# Altium schematic sheet GMSL_DESERIALIZER.SchDoc
size C; SheetNumber: 3; SheetTotal: 7
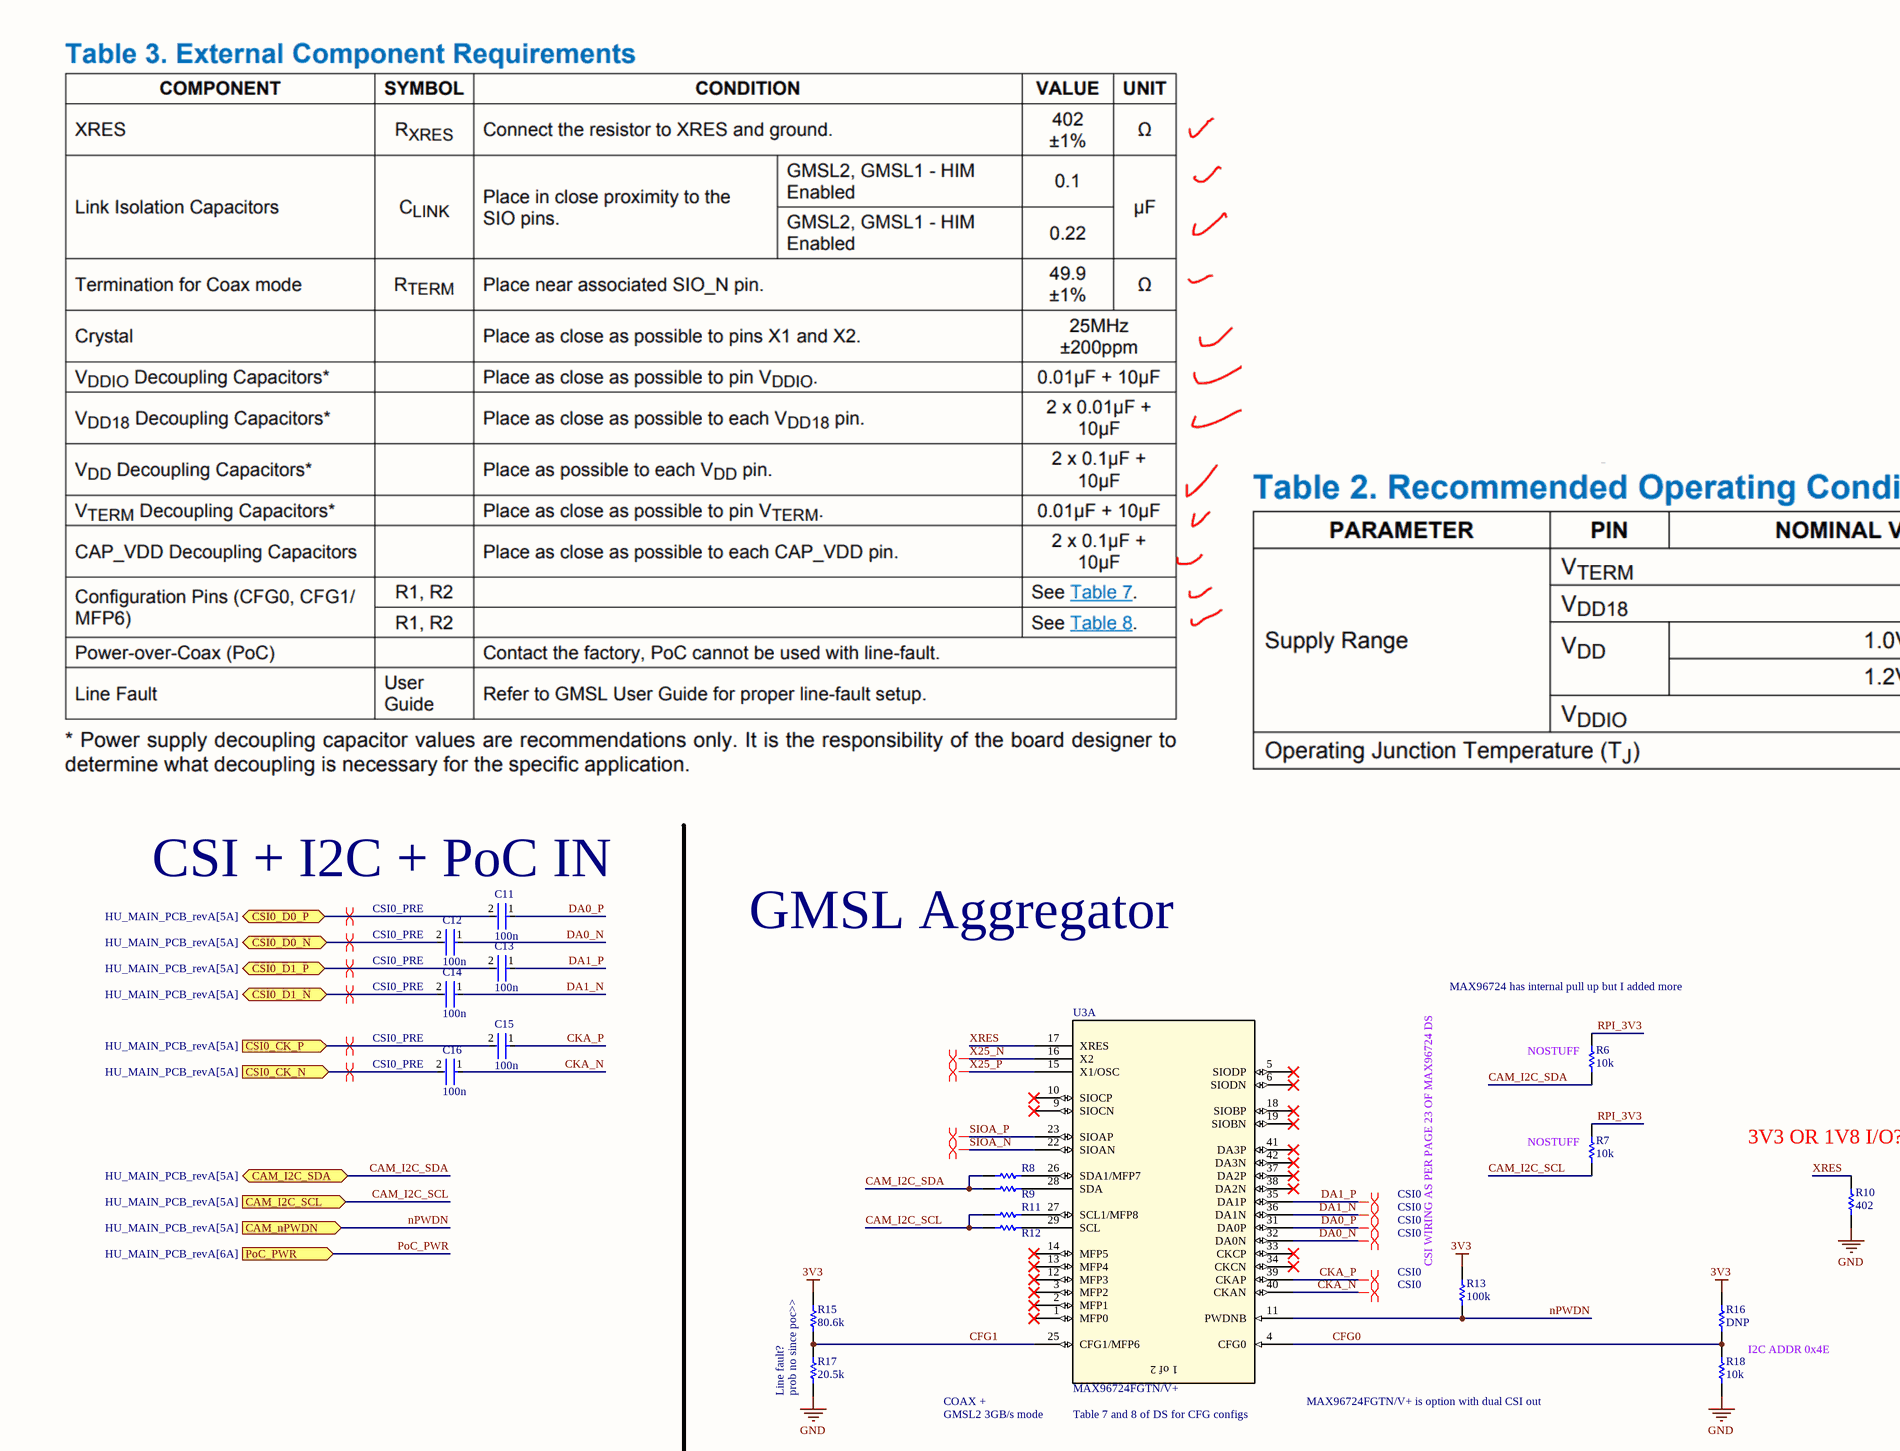
[diagram p0: GMSL_DESERIALIZER.SchDoc, top left]
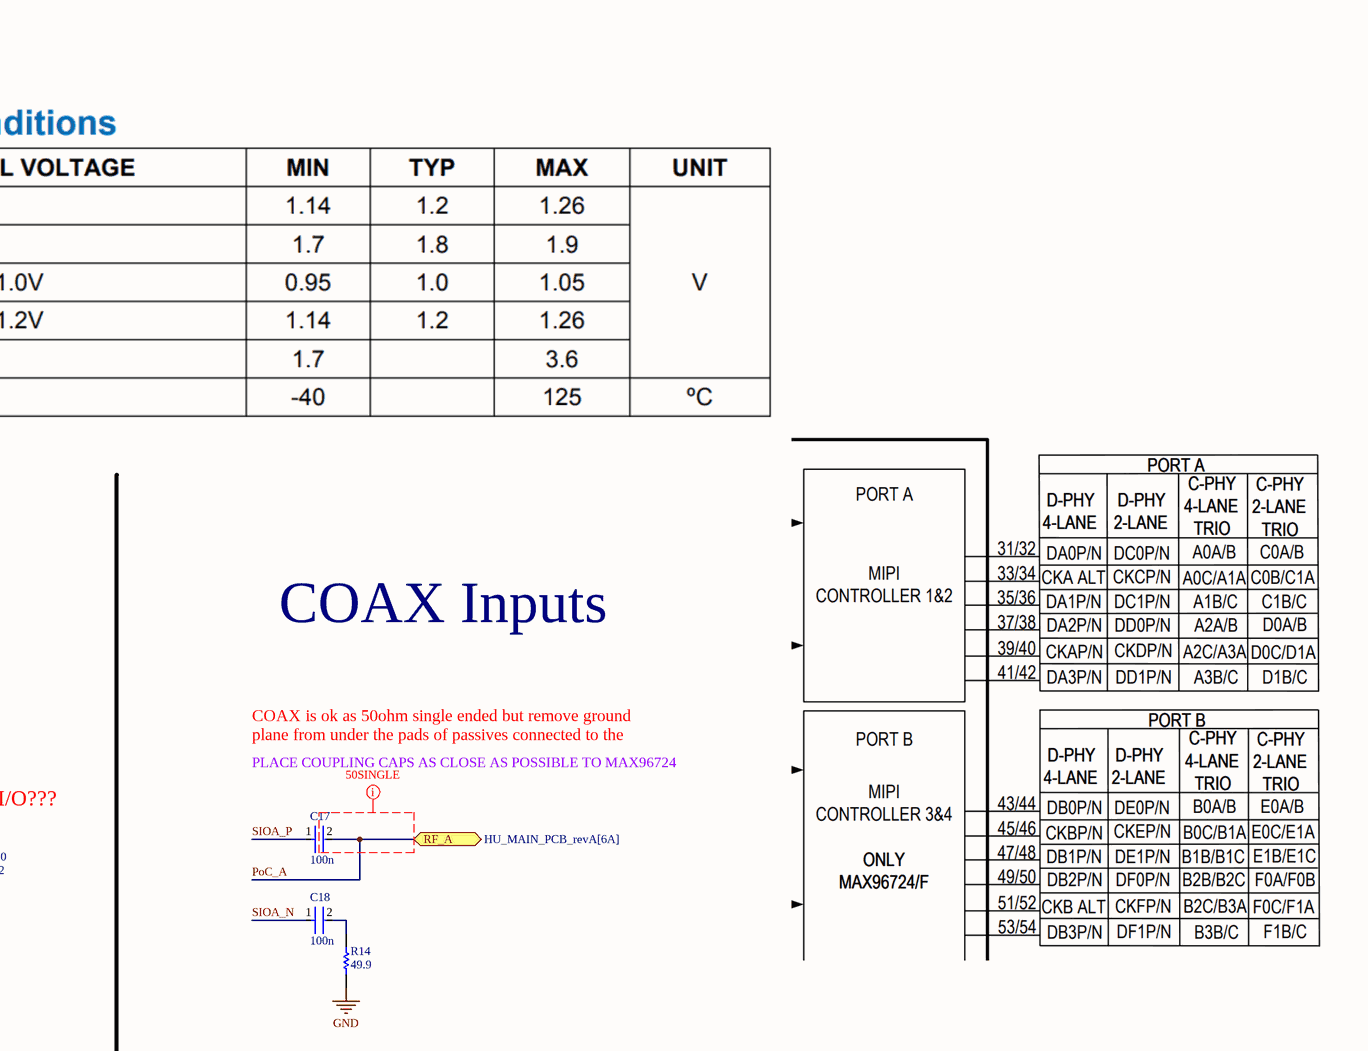
[diagram p1: GMSL_DESERIALIZER.SchDoc, top right]
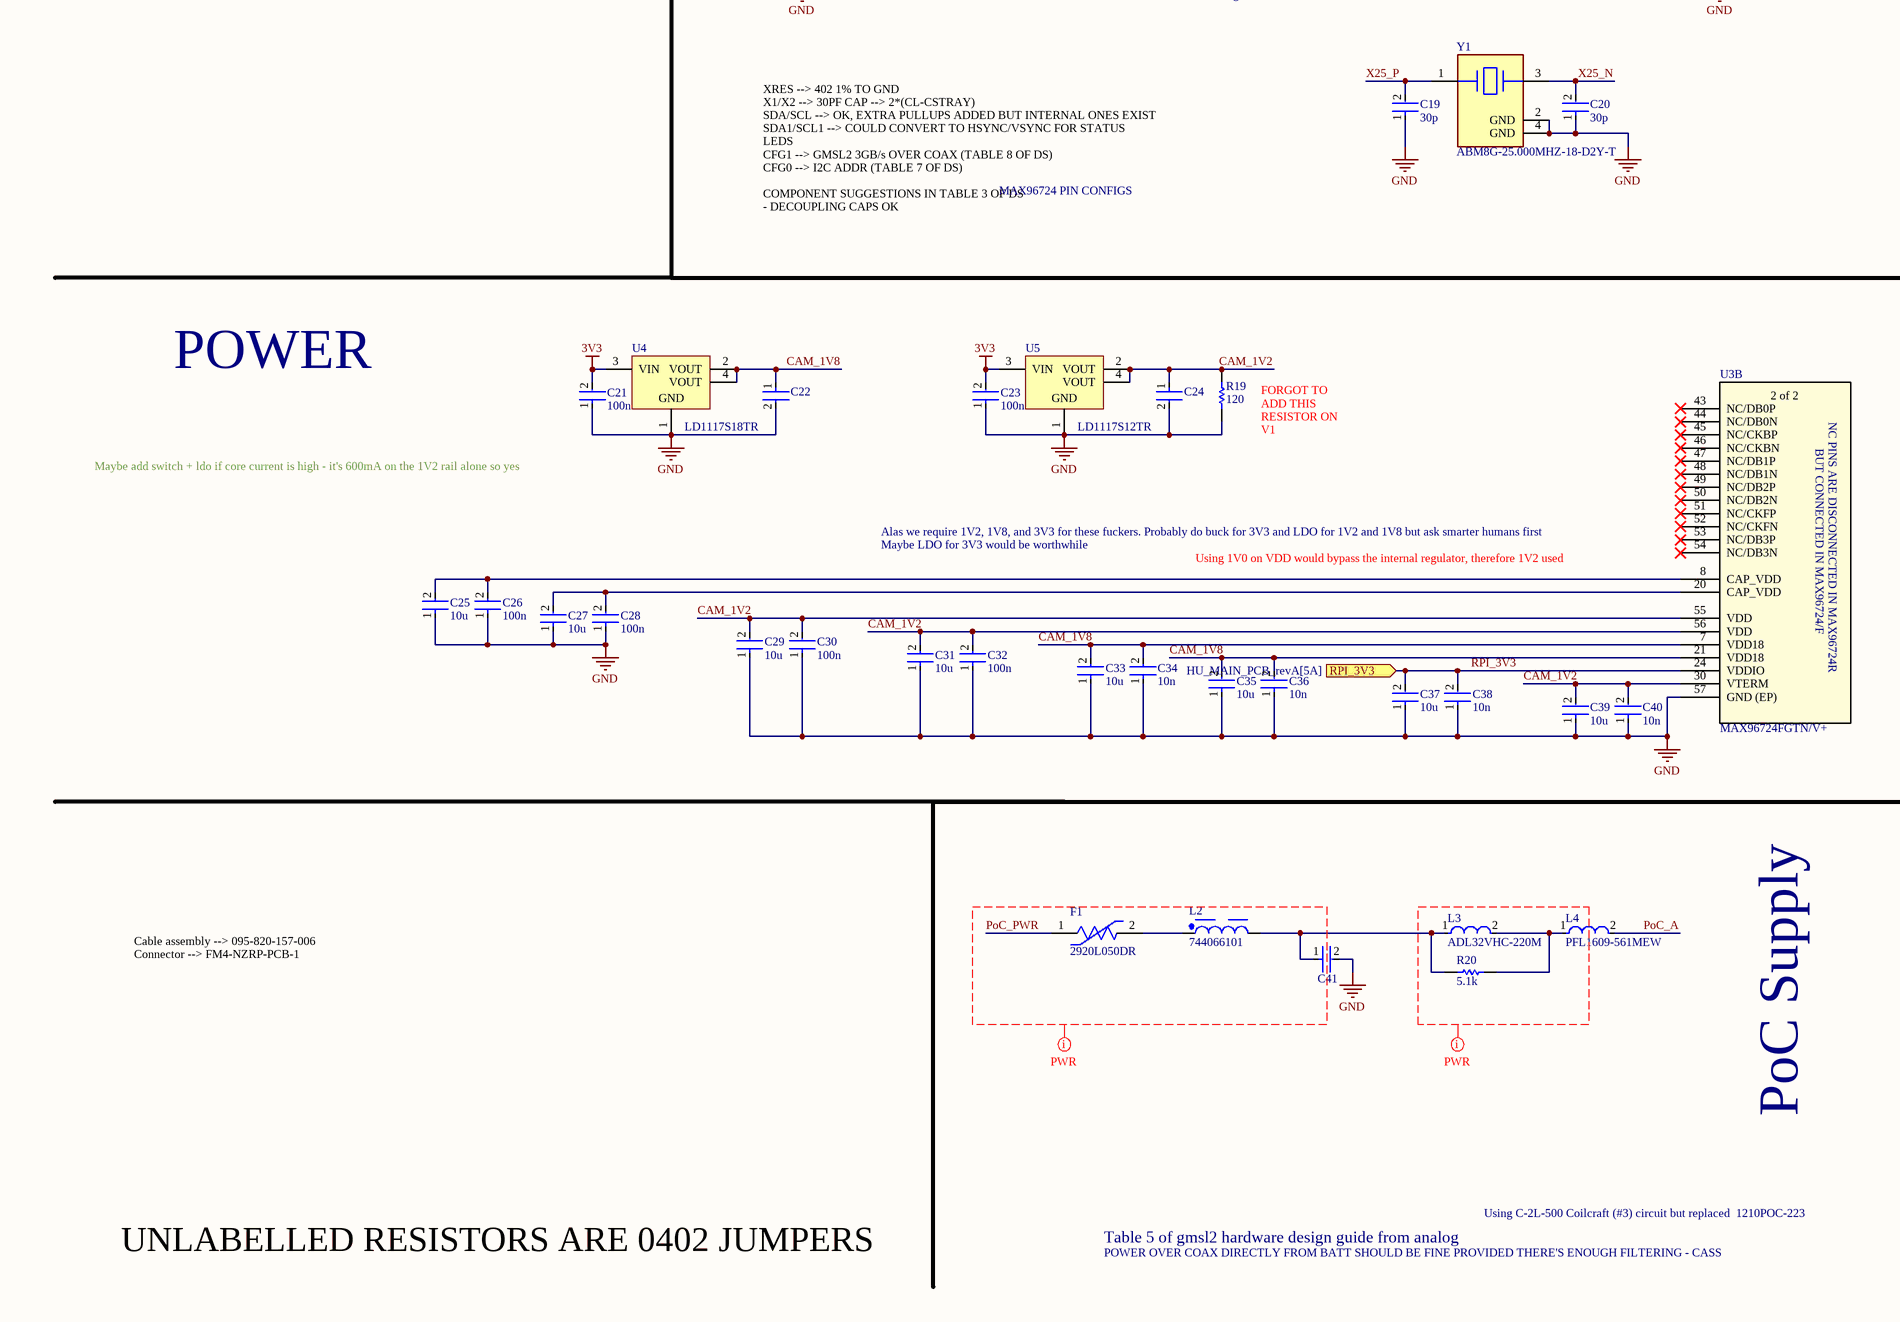
[diagram p2: GMSL_DESERIALIZER.SchDoc, bottom left]
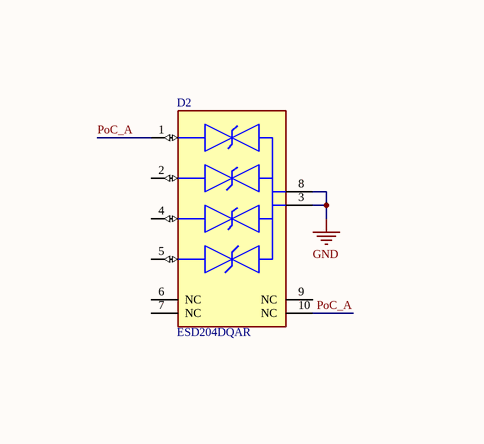
[diagram p3: GMSL_DESERIALIZER.SchDoc, bottom right]

## Parts
C11  100n  [FP-0402-L_1_0_0_05-W_0_5-IPC_A]
C12  100n  [FP-0402-L_1_0_0_05-W_0_5-IPC_A]
C13  100n  [FP-0402-L_1_0_0_05-W_0_5-IPC_A]
C14  100n  [FP-0402-L_1_0_0_05-W_0_5-IPC_A]
C15  100n  [FP-0402-L_1_0_0_05-W_0_5-IPC_A]
C16  100n  [FP-0402-L_1_0_0_05-W_0_5-IPC_A]
C17  100n  [FP-0402-L_1_0_0_05-W_0_5-IPC_A]
C18  100n  [FP-0402-L_1_0_0_05-W_0_5-IPC_A]
C19  30p  [FP-0402-L_1_0_0_05-W_0_5-IPC_A]
C20  30p  [FP-0402-L_1_0_0_05-W_0_5-IPC_A]
C21  100n  [FP-0402-L_1_0_0_05-W_0_5-IPC_A]
C22  GRM188R60J106ME47D  [FP-GRM188-0_1-e0_2_0_55-IPC_A]  (value not drawn)
C23  100n  [FP-0402-L_1_0_0_05-W_0_5-IPC_A]
C24  GRM188R60J106ME47D  [FP-GRM188-0_1-e0_2_0_55-IPC_A]  (value not drawn)
C25  10u  [FP-0402-L_1_0_0_05-W_0_5-IPC_A]
C26  100n  [FP-0402-L_1_0_0_05-W_0_5-IPC_A]
C27  10u  [FP-0402-L_1_0_0_05-W_0_5-IPC_A]
C28  100n  [FP-0402-L_1_0_0_05-W_0_5-IPC_A]
C29  10u  [FP-0402-L_1_0_0_05-W_0_5-IPC_A]
C30  100n  [FP-0402-L_1_0_0_05-W_0_5-IPC_A]
C31  10u  [FP-0402-L_1_0_0_05-W_0_5-IPC_A]
C32  100n  [FP-0402-L_1_0_0_05-W_0_5-IPC_A]
C33  10u  [FP-0402-L_1_0_0_05-W_0_5-IPC_A]
C34  10n  [FP-0402-L_1_0_0_05-W_0_5-IPC_A]
C35  10u  [FP-0402-L_1_0_0_05-W_0_5-IPC_A]
C36  10n  [FP-0402-L_1_0_0_05-W_0_5-IPC_A]
C37  10u  [FP-0402-L_1_0_0_05-W_0_5-IPC_A]
C38  10n  [FP-0402-L_1_0_0_05-W_0_5-IPC_A]
C39  10u  [FP-0402-L_1_0_0_05-W_0_5-IPC_A]
C40  10n  [FP-0402-L_1_0_0_05-W_0_5-IPC_A]
C41  GRM21BR61E226ME44L  [FP-GRM21B-0_2-e0_2_0_7-IPC_B]  (value not drawn)
D2  ESD204DQAR  [FP-DQA0010A-MFG]
F1  2920L050DR  [FP-2920L050DR-MFG]
L2  744066101  [WE-TPC_1038]
L3  ADL32VHC-220M  [FP-1210POC-MFG]
L4  PFL1609-561MEW  [FP-PFL1609-MFG]
R6  10k  [R0603B]
R7  10k  [R0603B]
R8  0402 JUMPER  [RESC1005X40X25ML05T05]  (value not drawn)
R9  0402 JUMPER  [RESC1005X40X25ML05T05]  (value not drawn)
R10  402  [R0603B]
R11  0402 JUMPER  [RESC1005X40X25ML05T05]  (value not drawn)
R12  0402 JUMPER  [RESC1005X40X25ML05T05]  (value not drawn)
R13  100k  [R0603B]
R14  49.9  [R0603B]
R15  80.6k  [R0603B]
R16  DNP  [R0603B]
R17  20.5k  [R0603B]
R18  10k  [R0603B]
R19  120  [R0603B]
R20  5.1k  [R0603B]
U3  MAX96724FGTN/V+  [MAX96724FGTN_V+-Footprint-1]  (parts A,B of 2)
U4  LD1117S18TR  [SOT-223_M]
U5  LD1117S12TR  [SOT-223_M]
Y1  ABM8G-25.000MHZ-18-D2Y-T  [FP-ABM8G-MFG]

## Ports
CAM_I2C_SCL (in, see HU_MAIN_PCB_revA[5A]), CAM_I2C_SDA (bidir, see HU_MAIN_PCB_revA[5A]), CAM_nPWDN (in, see HU_MAIN_PCB_revA[5A]), CSI0_CK_N (in, see HU_MAIN_PCB_revA[5A]), CSI0_CK_P (in, see HU_MAIN_PCB_revA[5A]), CSI0_D0_N (bidir, see HU_MAIN_PCB_revA[5A]), CSI0_D0_P (bidir, see HU_MAIN_PCB_revA[5A]), CSI0_D1_N (bidir, see HU_MAIN_PCB_revA[5A]), CSI0_D1_P (bidir, see HU_MAIN_PCB_revA[5A]), PoC_PWR (in, see HU_MAIN_PCB_revA[6A]), RF_A (bidir, see HU_MAIN_PCB_revA[6A]), RPI_3V3 (in, see HU_MAIN_PCB_revA[5A])

## Nets
3V3: C21.2 C23.2 R13.2 R15.2 R16.2 U4.3(VIN) U5.3(VIN)
GND: C19.1 C20.1 C21.1 C22.2 C23.1 C24.2 C25.1 C26.1 C27.1 C28.1 C29.1 C30.1 C31.1 C32.1 C33.1 C34.1 C35.1 C36.1 C37.1 C38.1 C39.1 C40.1 C41.2 D2.3(GND) D2.8(GND) R10.1 R14.1 R17.1 R18.1 R19.2 U3.57(GND_(EP)) U4.1(GND) U5.1(GND) Y1.2(GND) Y1.4(GND)
CAM_1V2: C24.1 C29.2 C30.2 C31.2 C32.2 C39.2 C40.2 R19.1 U3.30(VTERM) U3.55(VDD) U3.56(VDD) U5.2(VOUT) U5.4(VOUT)
CAM_1V8: C22.1 C33.2 C34.2 C35.2 C36.2 U3.7(VDD18) U3.21(VDD18) U4.2(VOUT) U4.4(VOUT)
CAM_I2C_SCL: R7.1 R11.1 R12.1 ; port CAM_I2C_SCL
CAM_I2C_SDA: R6.1 R8.1 R9.1 ; port CAM_I2C_SDA
CFG0: R16.1 R18.2 U3.4(CFG0)
CFG1: R15.1 R17.2 U3.25(CFG1/MFP6)
CKA_N: C16.1 U3.40(CKAN)
CKA_P: C15.1 U3.39(CKAP)
CSI0_CK_N: C16.2 ; port CSI0_CK_N
CSI0_CK_P: C15.2 ; port CSI0_CK_P
CSI0_D0_N: C12.2 ; port CSI0_D0_N
CSI0_D0_P: C11.2 ; port CSI0_D0_P
CSI0_D1_N: C14.2 ; port CSI0_D1_N
CSI0_D1_P: C13.2 ; port CSI0_D1_P
DA0_N: C12.1 U3.32(DA0N)
DA0_P: C11.1 U3.31(DA0P)
DA1_N: C14.1 U3.36(DA1N)
DA1_P: C13.1 U3.35(DA1P)
nPWDN: R13.1 U3.11(PWDNB) ; port CAM_nPWDN
PoC_A: C17.2 D2.1(IO1) D2.10(NC) L4.2 ; port RF_A
PoC_PWR: F1.1 ; port PoC_PWR
RPI_3V3: C37.2 C38.2 R6.2 R7.2 U3.24(VDDIO) ; port RPI_3V3
SIOA_N: C18.1 U3.22(SIOAN)
SIOA_P: C17.1 U3.23(SIOAP)
X25_N: C20.2 U3.16(X2) Y1.3
X25_P: C19.2 U3.15(X1/OSC) Y1.1
XRES: R10.2 U3.17(XRES)
NetC18_2: C18.2 R14.2
NetC25_2: C25.2 C26.2 U3.8(CAP_VDD)
NetC27_2: C27.2 C28.2 U3.20(CAP_VDD)
NetC41_1: C41.1 L2.2 L3.1 R20.2
NetF1_2: F1.2 L2.1
NetL3_2: L3.2 L4.1 R20.1
NetR8_2: R8.2 U3.26(SDA1/MFP7)
NetR9_2: R9.2 U3.28(SDA)
NetR11_2: R11.2 U3.27(SCL1/MFP8)
NetR12_2: R12.2 U3.29(SCL)

Not connected (* = marked no-connect by the designer): D2 2(IO2) 4(IO3) 5(IO4) 6(NC) 7(NC) 9(NC); U3 1(MFP0)* 2(MFP1)* 3(MFP2)* 5(SIODP)* 6(SIODN)* 9(SIOCN)* 10(SIOCP)* 12(MFP3)* 13(MFP4)* 14(MFP5)* 18(SIOBP)* 19(SIOBN)* 33(CKCP)* 34(CKCN)* 37(DA2P)* 38(DA2N)* 41(DA3P)* 42(DA3N)* 43(NC/DB0P)* 44(NC/DB0N)* 45(NC/CKBP)* 46(NC/CKBN)* 47(NC/DB1P)* 48(NC/DB1N)* 49(NC/DB2P)* 50(NC/DB2N)* 51(NC/CKFP)* 52(NC/CKFN)* 53(NC/DB3P)* 54(NC/DB3N)*

## Layout directives
differential pair; differential pair class 100DIFF: SIOA_N, SIOA_P
differential pair: X25_N, X25_P
net class PWR: (no net found under the mark), PoC_PWR
differential pair; differential pair class CSI0: CKA_N, CKA_P, DA0_N, DA0_P, DA1_N, DA1_P
differential pair; differential pair class CSI0_PRE: CSI0_CK_N, CSI0_CK_P, CSI0_D0_N, CSI0_D0_P, CSI0_D1_N, CSI0_D1_P
net class 50SINGLE: (no net found under the mark)

## Notes on the sheet
- (near C11) CSI + I2C + PoC IN
- GMSL Aggregator
- MAX96724 has internal pull up but I added more
- COAX Inputs
- (near R6) NOSTUFF
- COAX is ok as 50ohm single ended but remove ground plane from under the pads of passives connected to the GMSL trace
- PLACE COUPLING CAPS AS CLOSE AS POSSIBLE TO MAX96724
- (near R7) NOSTUFF
- (near R10) 3V3 OR 1V8 I/O???
- (near R13) CSI WIRING AS PER PAGE 23 OF MAX96724 DS
- Line fault?
- prob no since poc>>
- I2C ADDR 0x4E
- GMSL2 3GB/s mode
- COAX +
- Table 7 and 8 of DS for CFG configs
- MAX96724FGTN/V+ is option with dual CSI out
- XRES --> 402 1% TO GND
  X1/X2 --> 30PF CAP --> 2*(CL-CSTRAY)
  SDA/SCL --> OK, EXTRA PULLUPS ADDED BUT INTERNAL ONES EXIST
  SDA1/SCL1 --> COULD CONVERT TO HSYNC/VSYNC FOR STATUS LEDS
  CFG1 --> GMSL2 3GB/s OVER COAX (TABLE 8 OF DS)
  CFG0 --> I2C ADDR (TABLE 7 OF DS)
  COMPONENT SUGGESTIONS IN TABLE 3 OF DS
  - DECOUPLING CAPS OK
- MAX96724 PIN CONFIGS
- POWER
- (near R19) FORGOT TO ADD THIS RESISTOR ON V1
- Maybe add switch + ldo if core current is high - it's 600mA on the 1V2 rail alone so yes
- Alas we require 1V2, 1V8, and 3V3 for these fuckers. Probably do buck for 3V3 and LDO for 1V2 and 1V8 but ask smarter humans first
- Maybe LDO for 3V3 would be worthwhile
- Using 1V0 on VDD would bypass the internal regulator, therefore 1V2 used
- Cable assembly --> 095-820-157-006
  Connector --> FM4-NZRP-PCB-1
- PoC Supply
- Using C-2L-500 Coilcraft (#3) circuit but replaced  1210POC-223
- UNLABELLED RESISTORS ARE 0402 JUMPERS
- Table 5 of gmsl2 hardware design guide from analog
- POWER OVER COAX DIRECTLY FROM BATT SHOULD BE FINE PROVIDED THERE'S ENOUGH FILTERING - CASS
- (in symbol CMP-015-00011-3, part A) 1 of 2
- (in symbol CMP-015-00011-3, part B) 2 of 2; NC PINS ARE DISCONNECTED IN MAX96724R; BUT CONNECTED IN MAX96724/F

## Library data of the parts
C11-C16 C19-C21 C23 C25-C40 = CMP-001-00058-1: LARGE PADS, 0402 CAP, CHANGE COMMENT TO MATCH REAL P/N; Capacitor Type: Ceramic; Min Operating Temperature: -55°C; Mounting Technology: Surface Mount; Pins: 2; Case/Package: 0402; RoHS Compliant: Yes; Max Operating Temperature: 85°C
  C11-C16 C21 C23 C26 C28 C30 C32: Value: 100n
  C19 C20: Value: 30p
  C25 C27 C29 C31 C33 C35 C37 C39: Value: 10u
  C34 C36 C38 C40: Value: 10n
C17 C18 = CMP-001-00058-1: LARGE PADS, 0402 CAP, CHANGE COMMENT TO MATCH REAL P/N; Capacitor Type: Ceramic; Value: 220n; Min Operating Temperature: -55°C; Mounting Technology: Surface Mount; Pins: 2; Case/Package: 0402; RoHS Compliant: Yes; Max Operating Temperature: 85°C
C22 C24 = CMP-2006-02792-2: Chip Multilayer Ceramic Capacitors for General Purpose, 0603, 10uF, X5R, 15%, 20%, 6.3V; Packaging: Tape and Reel; Voltage Rating (DC): 6.3V; Width: 0.031inch; Termination: SMD/SMT; Dielectric: X5R; Package Quantity: 4000; Voltage Rating: 6.3V; Capacitance: 10uF; Case/Package: 0603; Min Operating Temperature: -55°C; Voltage: 6.3V; Length: 1.6mm; Thickness: 0.035inch; Lead Free: Lead Free; Depth: 0.8mm; Case Code (Imperial): 0603; Max Operating Temperature: 85°C; Material: Ceramic; Height: 0.8mm; Tolerance: 20%; Mount: Surface Mount; REACH SVHC: No SVHC; Radiation Hardening: No; Case Code (Metric): 1608
C41 = CMP-2007-03222-3: Chip Multilayer Ceramic Capacitors for General Purpose, 0805, 22uF, X5R, 15%, 20%, 25V; Case/Package: 0805; Depth: 1.25mm; Resistor Type: Ceramic; Voltage Rating: 25V; Lead Free: Lead Free; Voltage Rating (DC): 25V; Case Code (Metric): 2012; Thickness: 0.057inch; REACH SVHC: No SVHC; Material: Ceramic; Tolerance: 20%; Length: 2mm; Capacitance: 22uF; Case Code (Imperial): 0805; Max Operating Temperature: 85°C; Termination: SMD/SMT; Weight: 0.000335oz; Dielectric: X5R; Packaging: Tape and Reel; Voltage: 25V; Package Quantity: 3000; Height: 1.25mm; Mount: Surface Mount; Width: 1.25mm; Min Operating Temperature: -55°C
D2 = CMP-04989-000002-1: 4-CHANNEL LOW-CAPACITANCE SURGE; Manufacturer: Texas Instruments; Value: 0.55pF; Reverse Standoff Voltage: 3.6V; Standoff Height: 0mm; Breakdown Voltage: 5.5V; Peak Pulse Current: 5.5A; Clamping Voltage: 11.5V; Direction: Bidirectional; Peak Pulse Power: 50W; Number Of Channels: 4; Ambient Temperature Range High: +125°C; ComponentLink2Description: Datasheet; Height: 0.55mm; Lead Free: Yes; Device Class L3: unset; Temperature Range High: +125°C; Temperature Range Low: -40°C; Package: DQA0010A; Temperature: -40°C to +125°C; Capacitance: 0.55pF; RoHS: TRUE; Mouser Description: 4-Channel Low-Capacitance Surge and ESD Protection Diode 10-USON -40 to 125; Category: Diode; Device Class L1: Circuit Protection; Octopart: https://octopart.com/esd204dqar-texas+instruments-89917476; Device Class L2: TVS Diodes; Ambient Temperature Range Low: -40°C; Manufacturer Part Number: ESD204DQAR; ComponentLink2URL: http://www.ti.com/lit/ds/symlink/esd204.pdf; Automotive: No; Digikey Description: 4-CHANNEL LOW-CAPACITANCE SURGE
F1 = CMP-08606-000071-1: PTC RESET FUSE 60V 500MA 2920; Resistance: 1.4R; Trip Current: 1A; Power Dissipation: 1.5W; Time to Trip: 4s; Approvals: cULus; Current Rating: 10A; Operating Supply Voltage: 60V; Termination: SMD/SMT; Width: 5.44mm; Case/Package: 2920; Series: 2920L; Case Code (Imperial): 2920; Height: 1.25mm; Hold Current: 500mA; Terminal Material: Copper; Min Operating Temperature: -40°C; Package Quantity: 1500; Max Voltage Rating (DC): 60V; RoHS Compliant: Yes; Case Code (Metric): 7351; Lead Free: Lead Free; Max Operating Temperature: 85°C; Voltage Rating (DC): 60V; Working Voltage: 60V; Length: 7.98mm; REACH SVHC: No SVHC; Max Current Rating: 10A; Voltage Rating: 60V; Packaging: Tape and Reel
L2 = CMP-0227-00094-3: NexarPartId: 8917123; Current Rating: 1.2A; Shielding: Shielded; Core Material: Ferrite; Inductance: 100µH; Test Frequency: 100kHz; Tolerance: 30%; Resistance: 255mΩ; Self Resonant Frequency: 6MHz; Composition: Wirewound; Packaging: Cut Tape (CT); REACH SVHC: Unknown; Number of Pins: 2; Max DC Current: 1.2A; Saturation Current: 1.2A; Ambient Temperature Range High: 95°C; Weight: 1.273007g; Height: 3.8mm; Width: 10mm; Min Operating Temperature: -40°C; Max Operating Temperature: 125°C; Termination: SMD/SMT; Height - Seated (Max): 4.0894mm; Length: 10mm; RMS Current (Irms): 1.2A; Ambient Temperature Range Low: -40°C; RoHS: Compliant; Mount: Surface Mount; Depth: 10mm; DC Resistance (DCR): 255mΩ; Inductance Tolerance: 30%; Case/Package: Nonstandard
L3 = CMP-11268-000041-1: NOT COILCRAFT - ACTUAL P# --> ADL32VHC-220M / - Power Injection Chokes for PoC; Manufacturer Part Number: 1210POC-223MRC; Value: 22uH; Core Material: Ferrite; Saturation Current: 720mA; Series Resistance: 0.88Ω; Rms Current: 700mA; Automotive Grade: Grade 1; Self Resonant Frequency: 70MHz; Test Frequency: 100kHz; Tolerance: 20%; Ambient Temperature Range High: +125°C; Manufacturer: coilcraft; Octopart: https://octopart.com/1210poc-223mrc-coilcraft-103207315; Category: Ind; Device Class L2: Inductors; RoHS: TRUE; Device Class L3: Fixed Inductors; Package: 1210POC; Ambient Temperature Range Low: -40°C; ComponentLink2URL: https://drive.google.com/open?id=15FlOq8Y4YbRFohfA_cJ40jgnqs8va2Mh; Lead Free: Yes; Inductance: 22uH; Device Class L1: Passive Components; ComponentLink2Description: Datasheet; Automotive: Yes; Height: 3mm
L4 = CMP-11268-000007-1: Fixed Inductors PFL1609 Low Profile 0.56 uH 20 % 1.4 A; Manufacturer: coilcraft; Rms Current: 1100mA; Self Resonant Frequency: 600MHz; Core Material: Composite; Tolerance: 20%; Value: 0.56uH; Automotive Grade: Grade 1; Saturation Current: 710mA; Test Frequency: 7.9MHz; Shielding: true; Series Resistance: 130mΩ; Lead Free: Yes; Device Class L1: Passive Components; Package: PFL1609; Octopart: https://octopart.com/pfl1609-561mew-coilcraft-20329171; ComponentLink2URL: https://www.coilcraft.com/pdfs/pfl1609.pdf; Manufacturer Part Number: PFL1609-561MEW; Ambient Temperature Range Low: -40°C; Composition: Wirewound; Inductance: 0.56uH; Device Class L2: Inductors; Category: Ind; Device Class L3: Fixed Inductors; Mouser Description: Fixed Inductors PFL1609 Low Profile 0.56 uH 20 % 1.4 A; Automotive: Yes; ComponentLink2Description: Datasheet; Ambient Temperature Range High: +105°C; Height: 0.95mm; RoHS: TRUE
R6 R7 R10 R13-R20 = CMP-009-00002-14: Resistor
R8 R9 R11 R12 = CMP-009-00118-2: READ THE NAME; Pins: 2; Component Type: Standard; Design Item ID: CMP-009-00206-2; Source: 0402jump.SchLib
U3 = CMP-015-00011-3: Quad Tunneling GMSL2/1 to CSI-2 Deserializer
U4 = CMP-0244-00308-1: Fixed Low Drop Positive Voltage Regulator, 1.8V, 4-Pin SOT-223, Tape and Reel; ComponentLink1URL: http://www.st.com; PackageReference: SOT-223; PackageDescription: 4-Pin SOT-223 Package, 6.5 x 3.5 mm Body, 2.3 mm Pitch, 7 mm Lead Span; ComponentLink2URL: http://www.st.com/internet/com/TECHNICAL_RESOURCES/TECHNICAL_LITERATURE/DATASHEET/CD00000544.pdf; ComponentLink2Description: Datasheet; ComponentLink1Description: Manufacturer URL; DatasheetVersion: 1/11/2011; PackageVersion: 2010
U5 = CMP-0244-00318-1: Fixed Low Drop Positive Voltage Regulator, 1.2V, 4-Pin SOT-223, Tape and Reel; PackageDescription: 4-Pin SOT-223 Package, 6.5 x 3.5 mm Body, 2.3 mm Pitch, 7 mm Lead Span; PackageVersion: 2010; ComponentLink2Description: Datasheet; PackageReference: SOT-223; ComponentLink2URL: http://www.st.com/internet/com/TECHNICAL_RESOURCES/TECHNICAL_LITERATURE/DATASHEET/CD00000544.pdf; ComponentLink1Description: Manufacturer URL; DatasheetVersion: 1/11/2011; ComponentLink1URL: http://www.st.com
Y1 = CMP-2000-05733-3: Crystal 25MHz ±20ppm (Tol) ±30ppm (Stability) 18pF FUND 60Ω 4-Pin SMD T/R; Series Resistance: 60R; Length: 3.2mm; Depth: 2.5mm; Packaging: Tape and Reel; Min Operating Temperature: -40°C; Operating Frequency: 25 MHz; Lead Free: Lead Free; Number of Pins: 4; Frequency Tolerance: 20ppm; Radiation Hardening: No; Max Operating Temperature: 85°C; Termination: SMD/SMT; Frequency Stability: 30ppm; Frequency: 25MHz; Series: ABM8G; Mount: Surface Mount; Package Quantity: 1000; Height: 0.039inch; Width: 0.098inch; Case/Package: CSMD; ESR (Equivalent Series Resistance): 60R; Load Capacitance: 18pF; Tolerance: 20ppm